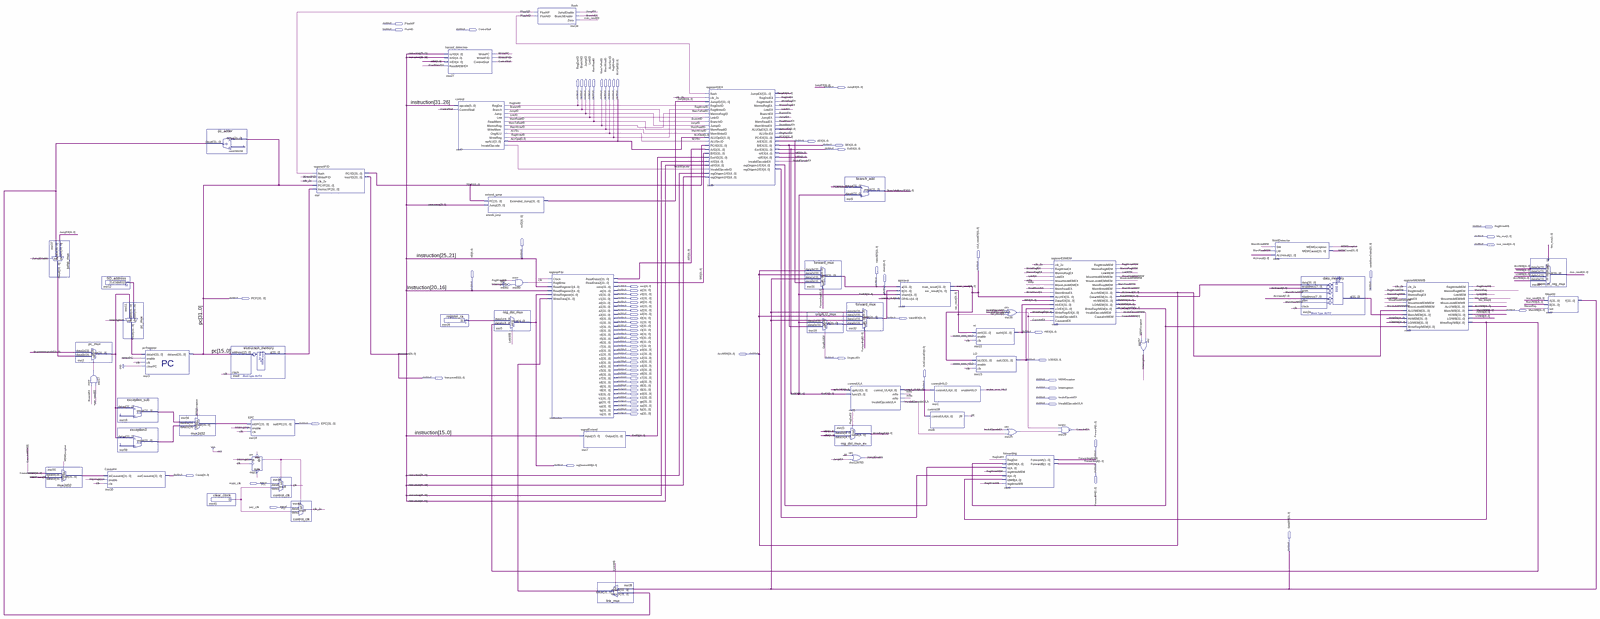
[diagram p0: schematic sheet, whole]
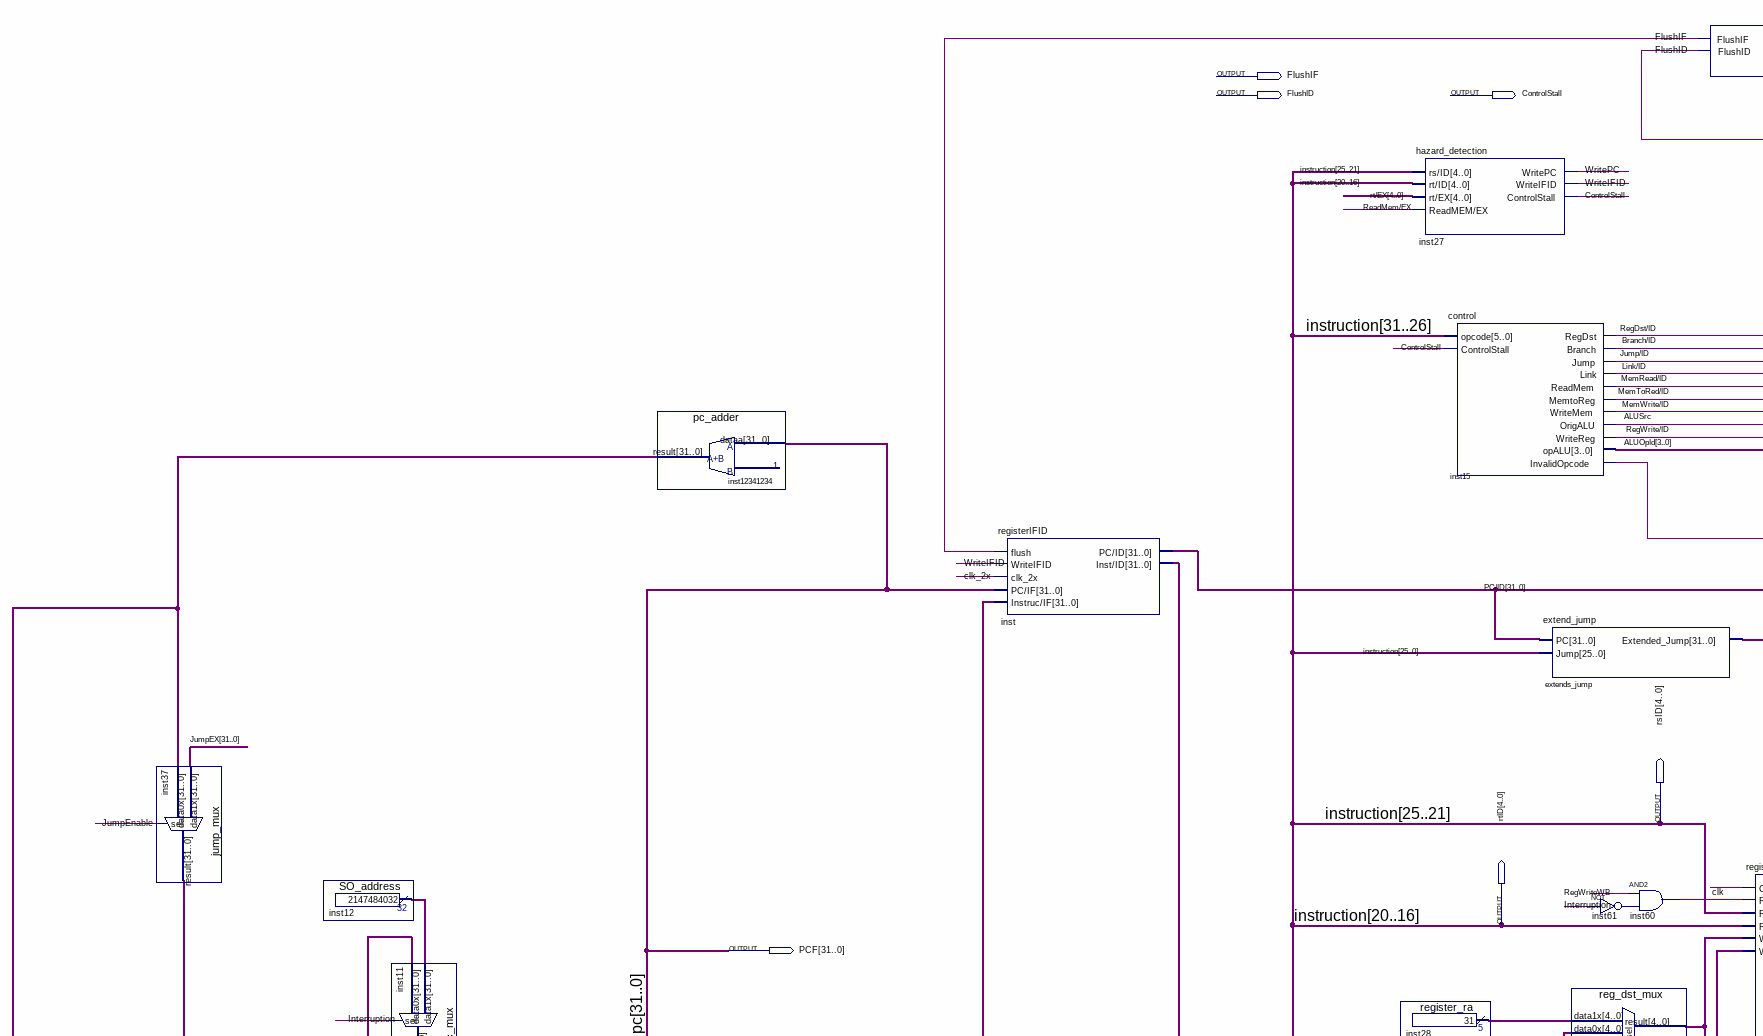
[diagram p1: schematic sheet, upper left part]
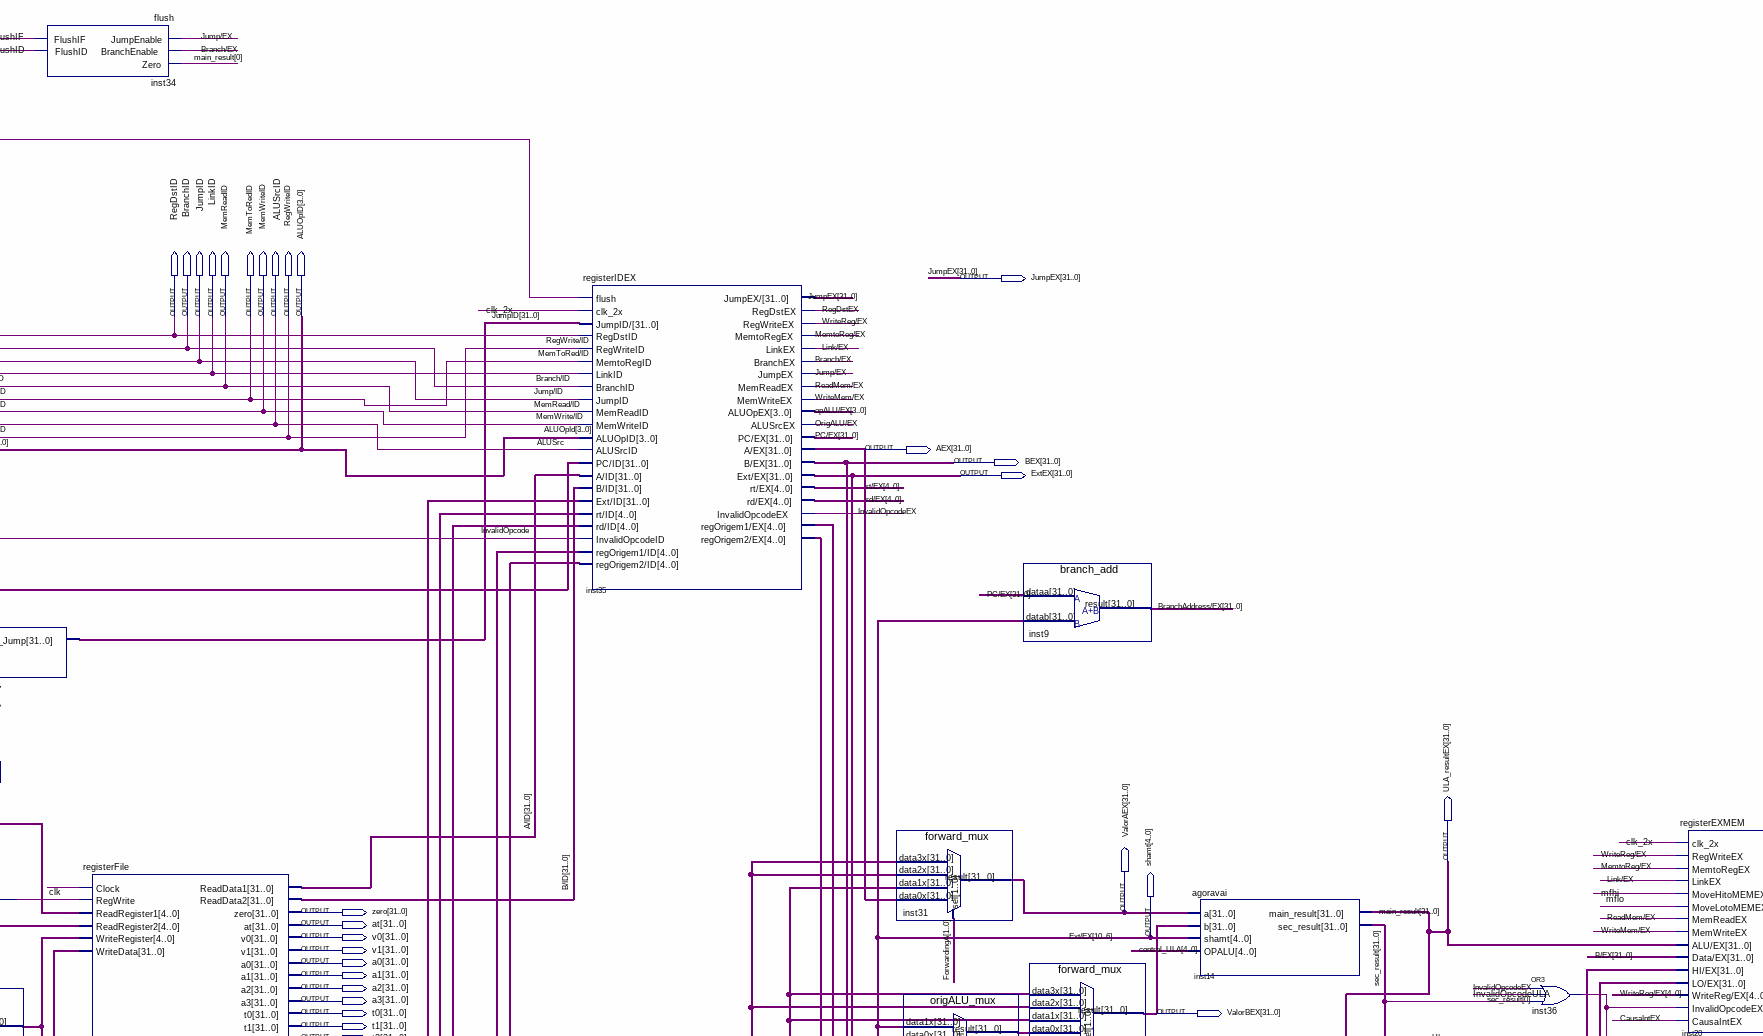
[diagram p2: schematic sheet, upper centre part]
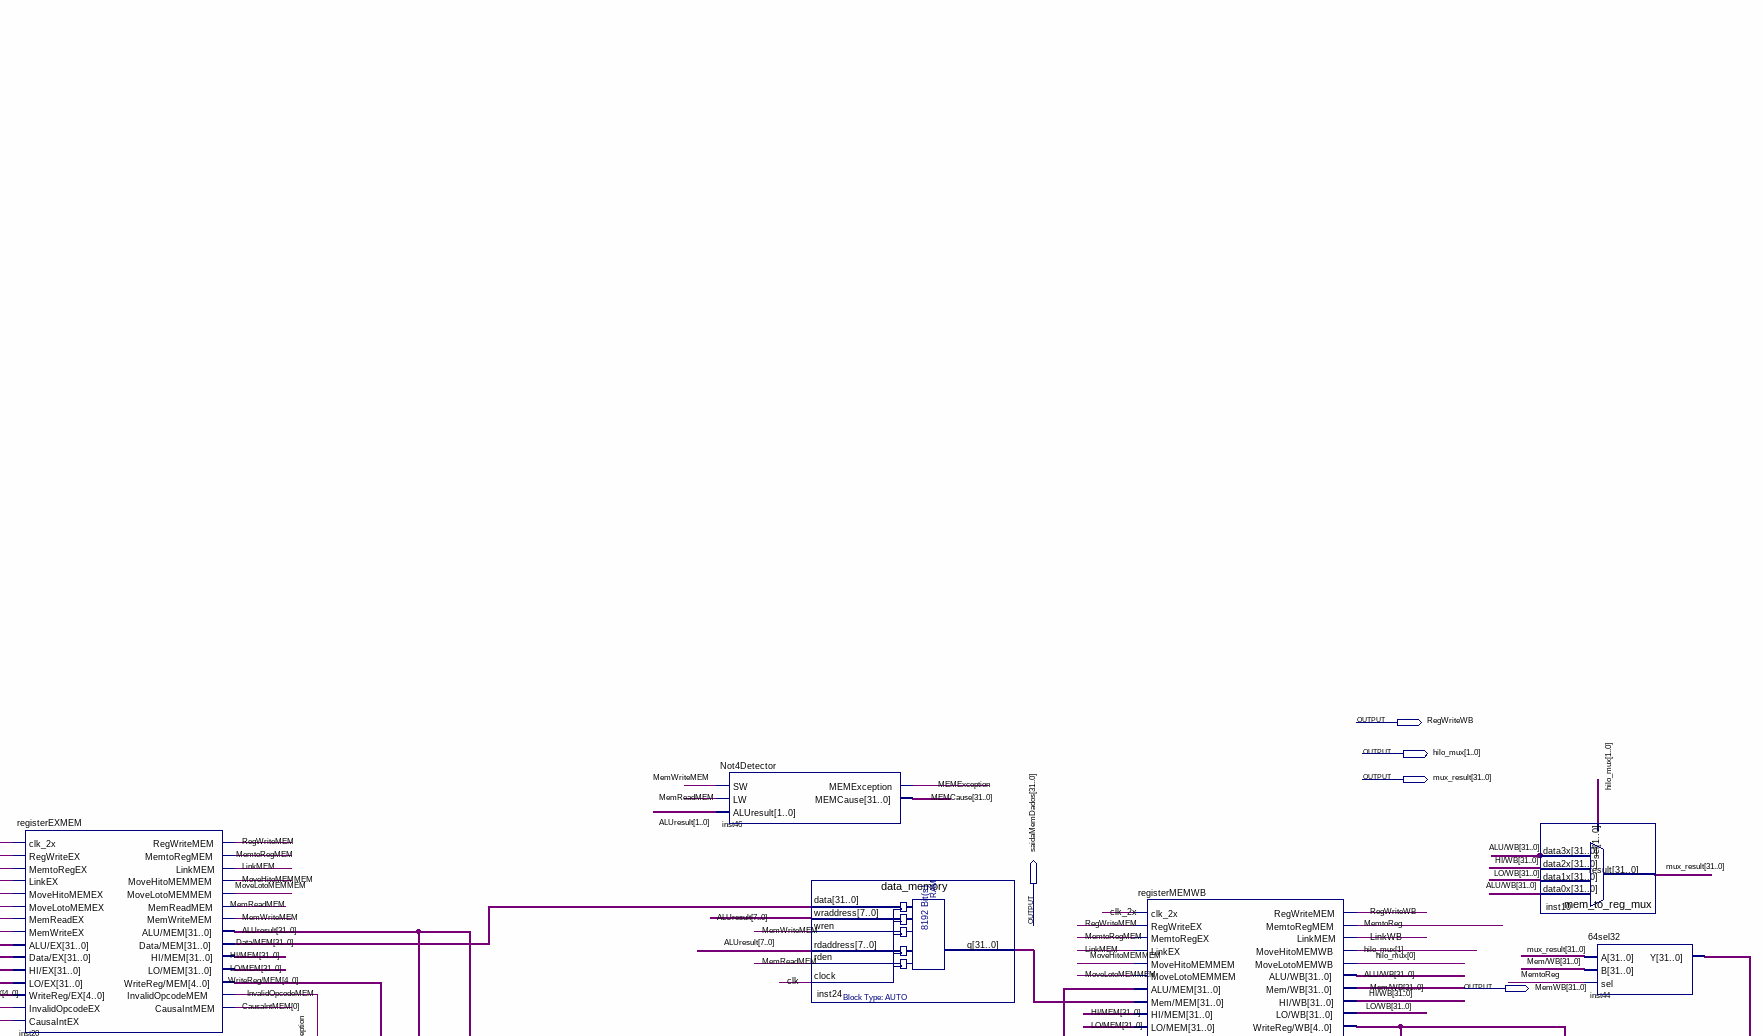
[diagram p3: schematic sheet, upper right part]
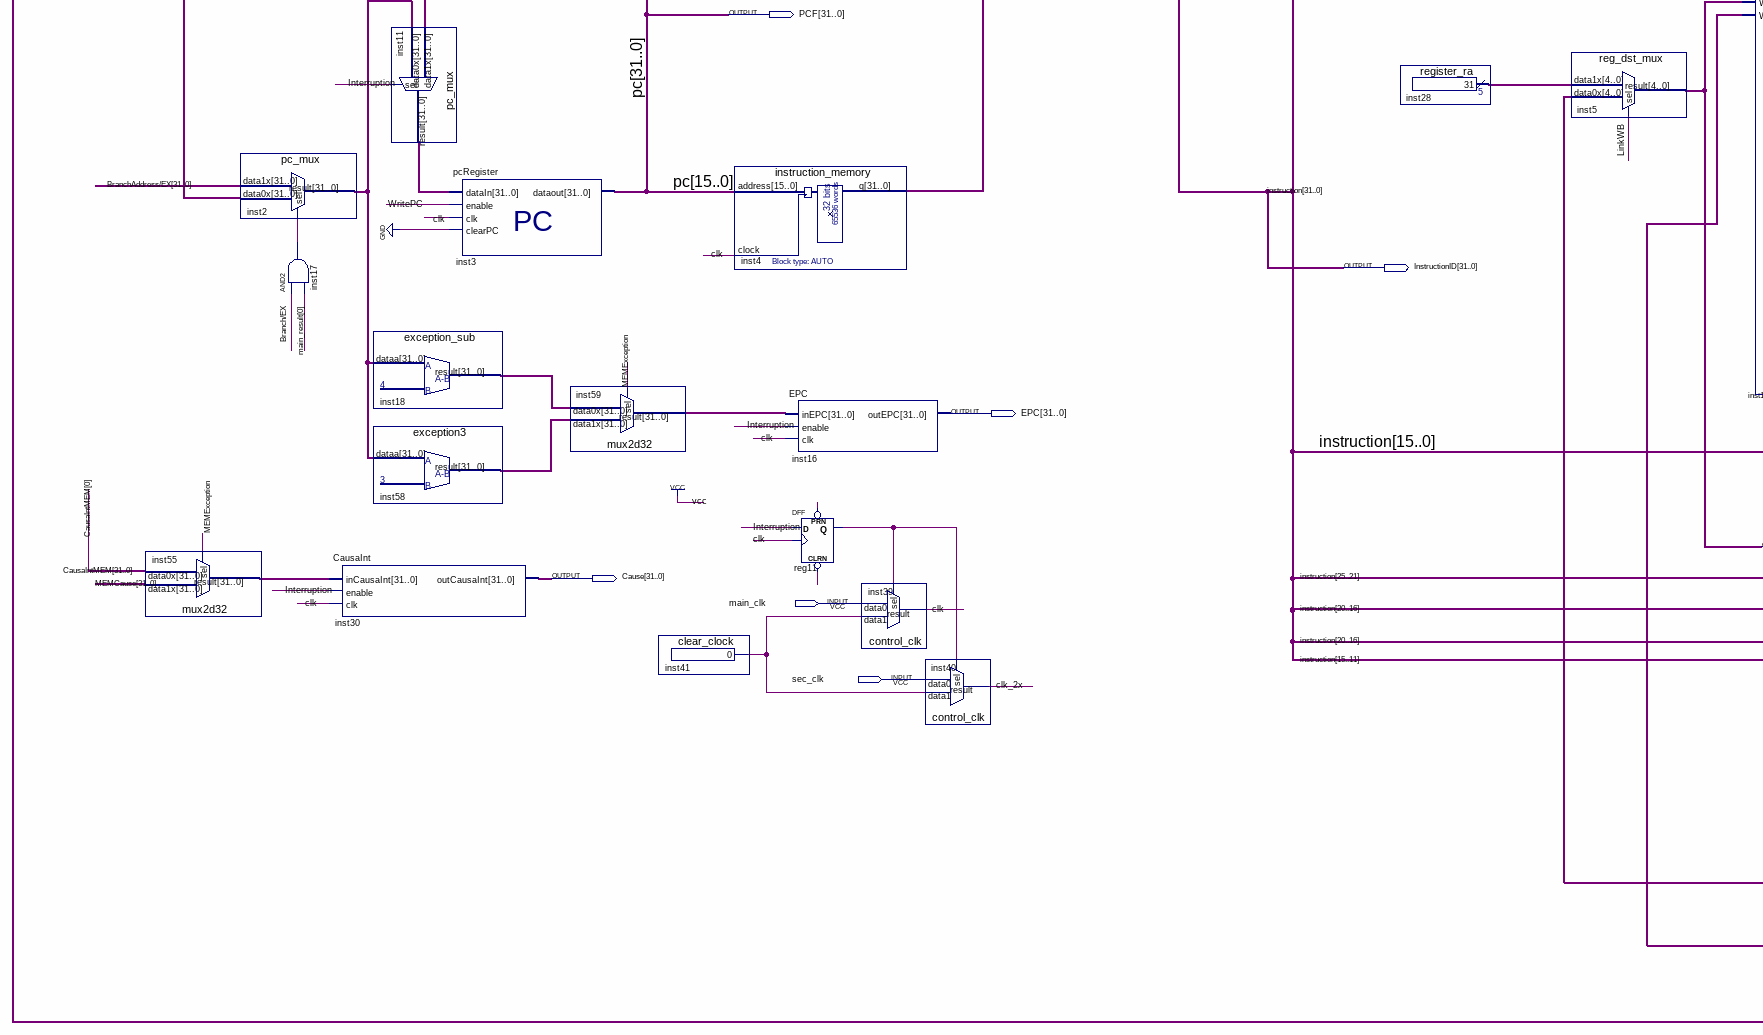
[diagram p4: schematic sheet, lower left part]
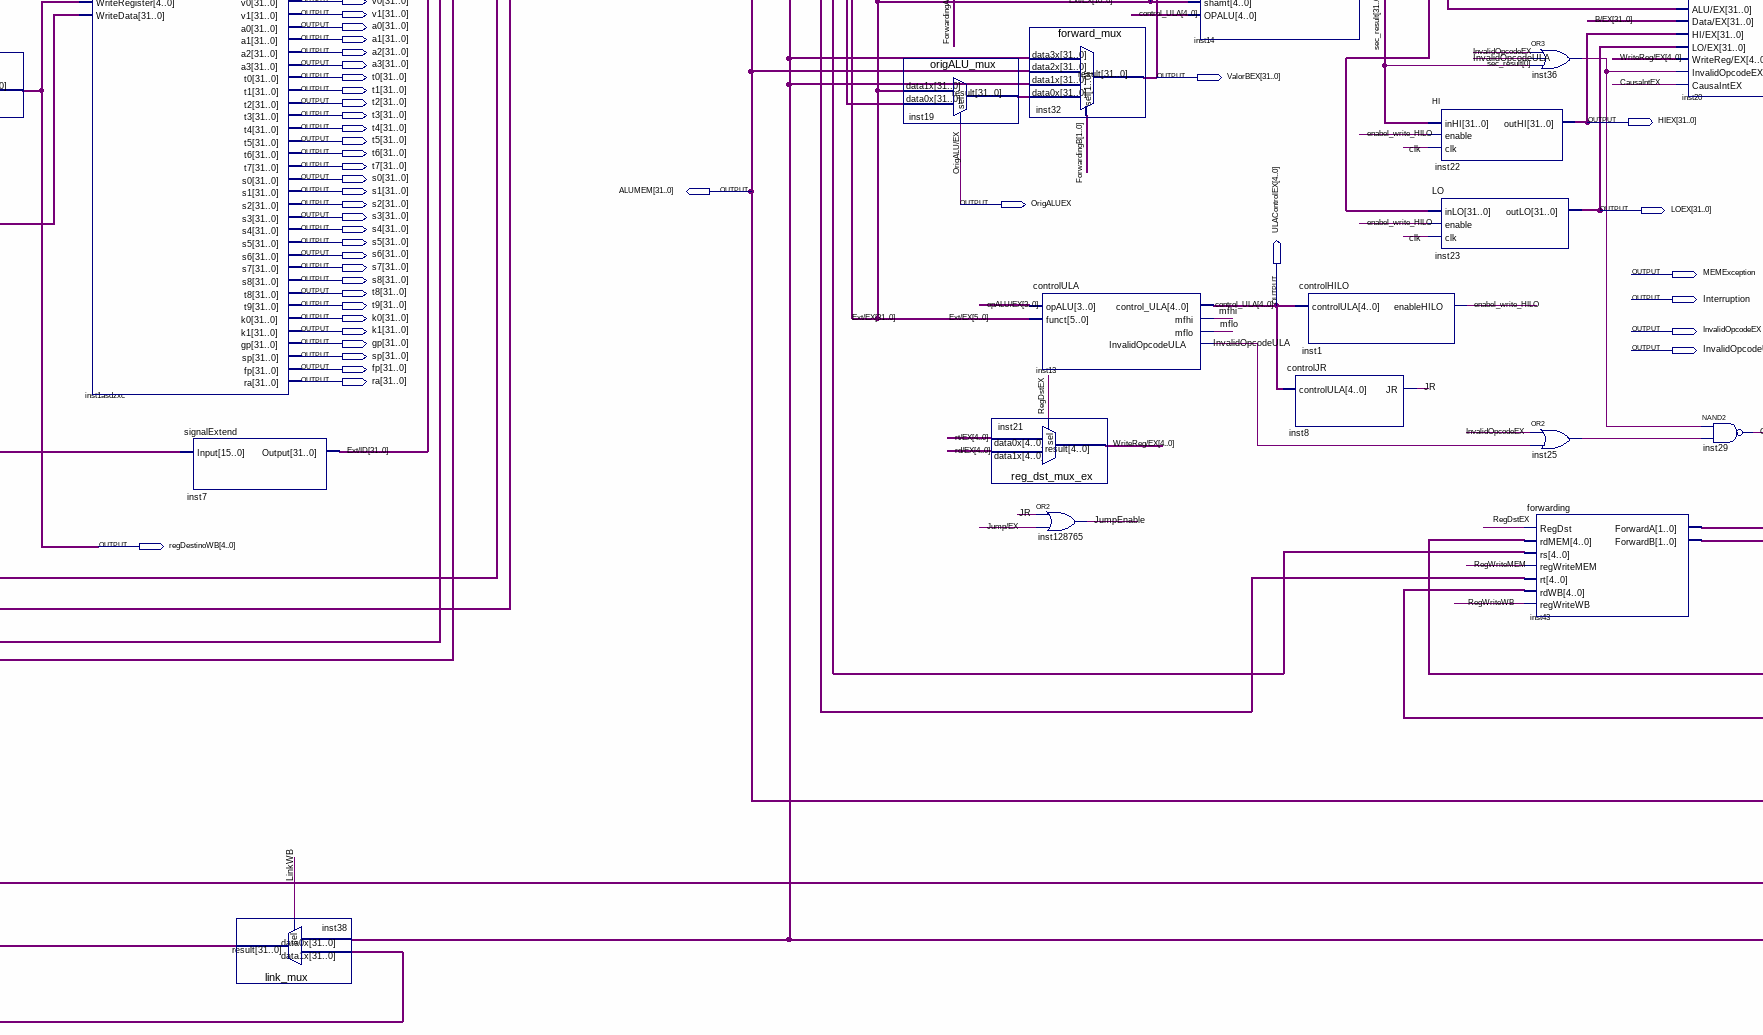
[diagram p5: schematic sheet, lower centre part]
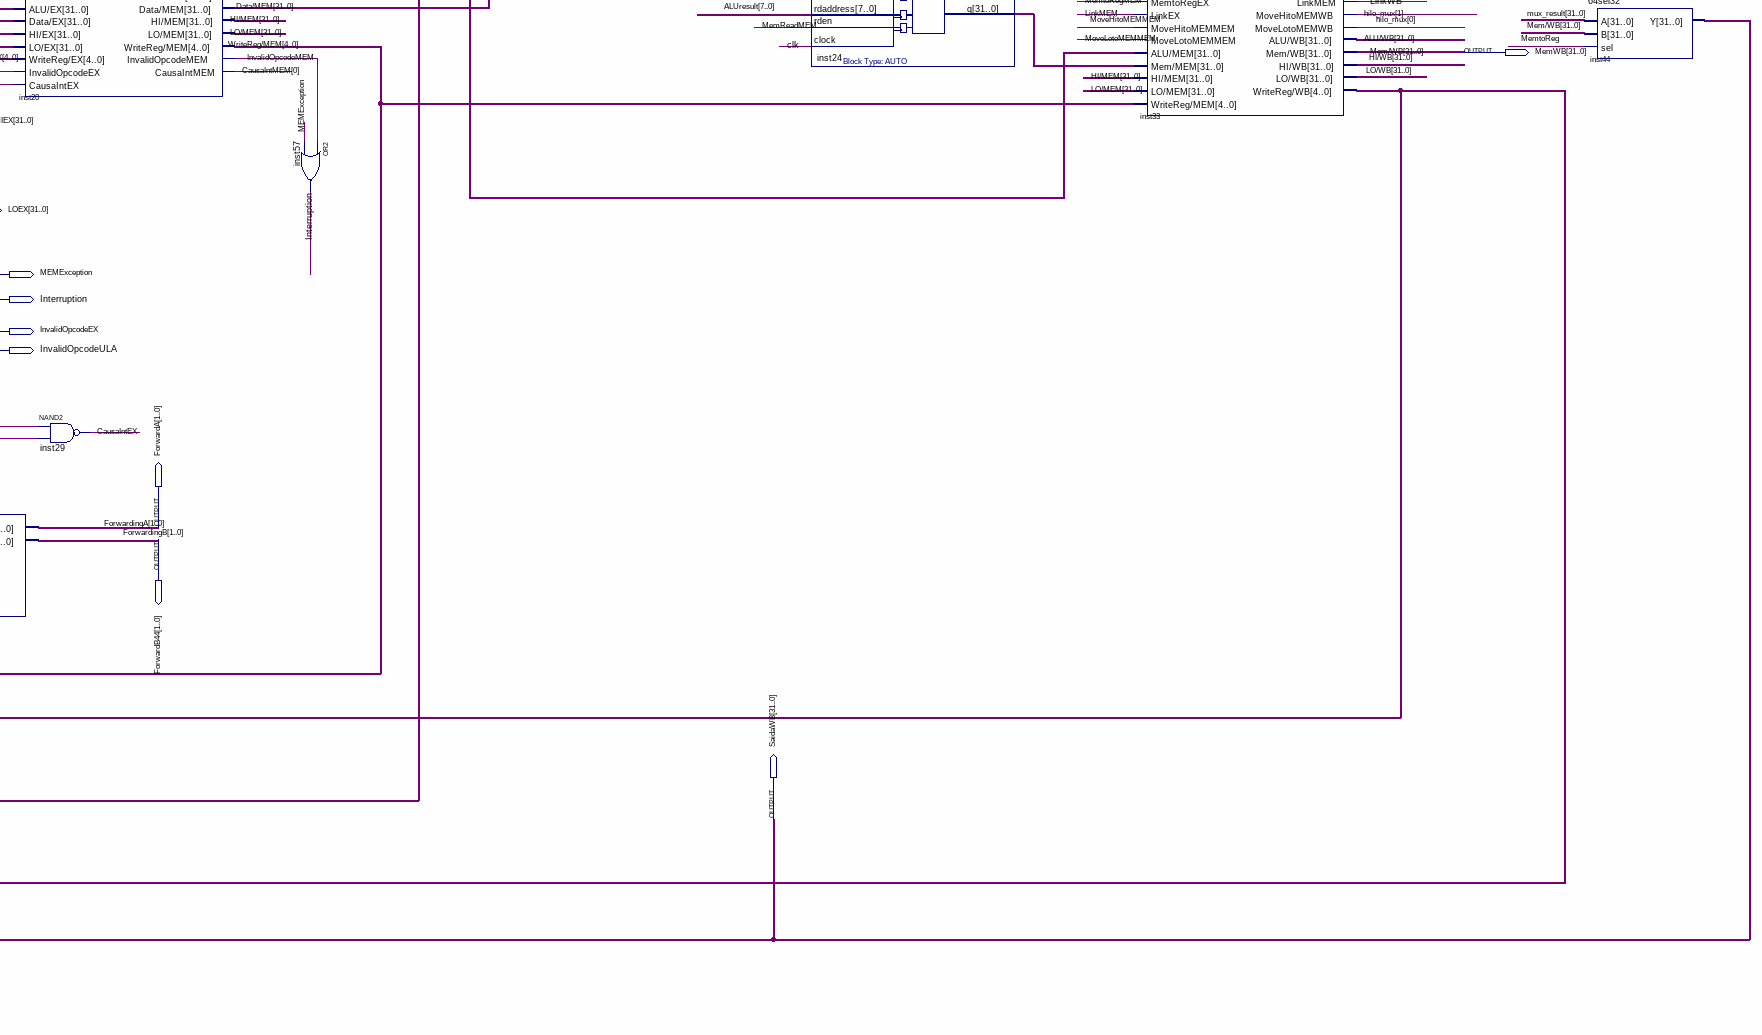
[diagram p6: schematic sheet, lower right part]
// Quartus schematic lab2.bdf as structural Verilog: 54 symbols, 80 pins
module lab2 (
  input  main_clk,
  input  sec_clk,
  output FlushIF,
  output FlushID,
  output ControlStall,
  output [31:0] JumpEX,
  output RegDstID,
  output BranchID,
  output JumpID,
  output LinkID,
  output MemReadID,
  output MemToRedID,
  output MemWriteID,
  output ALUSrcID,
  output RegWriteID,
  output [3:0] ALUOpID,
  output [31:0] AEX,
  output [31:0] BEX,
  output [31:0] ExtEX,
  output RegWriteWB,
  output [1:0] hilo_mux,
  output [31:0] mux_result,
  output [4:0] rsID,
  output [31:0] ULA_resultEX,
  output [31:0] zero,
  output [31:0] ValorAEX,
  output [4:0] rtID,
  output [31:0] at,
  output [31:0] saidaMemDados,
  output [31:0] v0,
  output [4:0] shamt,
  output [31:0] PCF,
  output [31:0] v1,
  output [31:0] a0,
  output [31:0] a1,
  output [31:0] a2,
  output [31:0] MemWB,
  output [31:0] a3,
  output [31:0] t0,
  output [31:0] ValorBEX,
  output [31:0] t1,
  output [31:0] t2,
  output [31:0] t3,
  output [31:0] HIEX,
  output [31:0] t4,
  output [31:0] t5,
  output [31:0] t6,
  output [31:0] t7,
  output [31:0] s0,
  output [31:0] s1,
  output [31:0] ALUMEM,
  output [31:0] s2,
  output OrigALUEX,
  output [31:0] LOEX,
  output [31:0] s3,
  output [31:0] s4,
  output [31:0] s5,
  output [31:0] s6,
  output [31:0] InstructionID,
  output [31:0] s7,
  output MEMException,
  output [31:0] s8,
  output [31:0] t8,
  output Interruption,
  output [31:0] t9,
  output [4:0] ULAControlEX,
  output [31:0] k0,
  output [31:0] k1,
  output InvalidOpcodeEX,
  output [31:0] gp,
  output InvalidOpcodeULA,
  output [31:0] sp,
  output [31:0] fp,
  output [31:0] ra,
  output [31:0] EPC,
  output [1:0] ForwardA,
  output [1:0] ForwardB44,
  output [4:0] regDestinoWB,
  output [31:0] Cause,
  output [31:0] SaidaWB
);

  wire \Branch/EX , CausaIntEX, clk, clk_2x, enabel_write_HILO, inst17_out, inst25_out, inst36_out,
       inst41_result, inst60_out, inst61_out, InvalidOpcode, InvalidOpcodeMEM, JR, \Jump/EX , JumpEnable,
       \Link/EX , LinkMEM, LinkWB, MemReadMEM, MemtoReg, \MemtoReg/EX , MemtoRegMEM, MemWriteMEM, mfhi, mflo,
       MoveHitoMEMMEM, MoveLotoMEMMEM, \ReadMem/EX , reg11_q, RegDstEX, RegWriteMEM, WriteIFID,
       \WriteMem/EX , WritePC, \WriteReg/EX_1bit ;
  wire [3:0] \opALU/EX ;
  wire [4:0] inst28_result, inst33_writereg_wb, inst35_regorigem1_ex, inst35_regorigem2_ex, \rd/EX , \rt/EX ,
       \WriteReg/EX , \WriteReg/MEM ;
  wire [31:0] \A/ID , \ALU/WB , \B/ID , \BranchAddress/EX , CausaIntMEM, \Data/MEM , \Ext/ID , \HI/MEM ,
       \HI/WB , inst2_result, inst4_q, inst11_result, inst12_result, inst18_result, inst19_result, inst24_q,
       inst37_result, inst38_result, inst55_result, inst58_result, inst59_result, inst12341234_result,
       JumpID_bus, \LO/MEM , \LO/WB , MEMCause, \PC/EX , \PC/ID , sec_result;

  jump_mux inst37 (.data1x(JumpEX), .data0x(inst12341234_result), .sel(JumpEnable), .result(inst37_result));
  mux2d32 inst55 (.data1x(MEMCause), .data0x(CausaIntMEM), .sel(MEMException), .result(inst55_result));
  pc_mux inst2 (.data1x(\BranchAddress/EX ), .data0x(inst37_result), .sel(inst17_out), .result(inst2_result));
  and inst17 (inst17_out, \Branch/EX , ULA_resultEX[0]);
  SO_address inst12 (.result(inst12_result));
  CausaInt inst30 (.inCausaInt(inst55_result), .enable(Interruption), .clk(clk), .outCausaInt(Cause));
  pc_mux inst11 (.data1x(inst12_result), .data0x(inst2_result), .sel(Interruption), .result(inst11_result));
  exception_sub inst18 (.dataa(inst2_result), .result(inst18_result));
  exception3 inst58 (.dataa(inst2_result), .result(inst58_result));
  pcRegister inst3 (.dataIn(inst11_result), .enable(WritePC), .clk(clk), .clearPC(1'b0), .dataout(PCF));
  mux2d32 inst59 (.data1x(inst58_result), .data0x(inst18_result), .sel(MEMException), .result(inst59_result));
  pc_adder inst12341234 (.dataa(PCF), .result(inst12341234_result));
  clear_clock inst41 (.result(inst41_result));
  instruction_memory inst4 (.address(PCF[15:0]), .clock(clk), .q(inst4_q));
  EPC inst16 (.inEPC(inst59_result), .enable(Interruption), .clk(clk), .outEPC(EPC));
  DFF reg11 (.CLRN(1'b1), .CLK(clk), .D(Interruption), .PRN(1'b1), .Q(reg11_q));
  control_clk inst39 (.data1(inst41_result), .data0(main_clk), .sel(reg11_q), .result(clk));
  control_clk inst40 (.data1(inst41_result), .data0(sec_clk), .sel(reg11_q), .result(clk_2x));
  registerIFID inst (
    .flush(FlushIF), .WriteIFID(WriteIFID), .clk_2x(clk_2x), .\PC/IF (PCF), .\Instruc/IF (inst4_q),
    .\PC/ID (\PC/ID ), .\Inst/ID (InstructionID));
  register_ra inst28 (.result(inst28_result));
  hazard_detection inst27 (
    .\rs/ID (InstructionID[25:21]), .\rt/ID (InstructionID[20:16]), .\rt/EX (\rt/EX ),
    .\ReadMEM/EX (\ReadMem/EX ), .WritePC(WritePC), .WriteIFID(WriteIFID), .ControlStall(ControlStall));
  control inst15 (
    .opcode(InstructionID[31:26]), .ControlStall(ControlStall), .RegDst(RegDstID), .Branch(BranchID),
    .Jump(JumpID), .Link(LinkID), .ReadMem(MemReadID), .MemtoReg(MemToRedID), .WriteMem(MemWriteID),
    .OrigALU(ALUSrcID), .WriteReg(RegWriteID), .opALU(ALUOpID), .InvalidOpcode(InvalidOpcode));
  extend_jump extends_jump (.PC(\PC/ID ), .Jump(InstructionID[25:0]), .Extended_Jump(JumpID_bus));
  not inst61 (inst61_out, Interruption);
  reg_dst_mux inst5 (.data1x(inst28_result), .data0x(inst33_writereg_wb), .sel(LinkWB), .result(regDestinoWB));
  and inst60 (inst60_out, RegWriteWB, inst61_out);
  flush inst34 (
    .JumpEnable(\Jump/EX ), .BranchEnable(\Branch/EX ), .Zero(ULA_resultEX[0]), .FlushIF(FlushIF),
    .FlushID(FlushID));
  registerFile inst1asdzxc (
    .Clock(clk), .RegWrite(inst60_out), .ReadRegister1(InstructionID[25:21]),
    .ReadRegister2(InstructionID[20:16]), .WriteRegister(regDestinoWB), .WriteData(inst38_result),
    .ReadData1(\A/ID ), .ReadData2(\B/ID ), .zero(zero), .at(at), .v0(v0), .v1(v1), .a0(a0), .a1(a1),
    .a2(a2), .a3(a3), .t0(t0), .t1(t1), .t2(t2), .t3(t3), .t4(t4), .t5(t5), .t6(t6), .t7(t7), .s0(s0),
    .s1(s1), .s2(s2), .s3(s3), .s4(s4), .s5(s5), .s6(s6), .s7(s7), .s8(s8), .t8(t8), .t9(t9), .k0(k0),
    .k1(k1), .gp(gp), .sp(sp), .fp(fp), .ra(ra));
  signalExtend inst7 (.Input(InstructionID[15:0]), .Output(\Ext/ID ));
  link_mux inst38 (.data1x(inst12341234_result), .data0x(SaidaWB), .sel(LinkWB), .result(inst38_result));
  registerIDEX inst35 (
    .flush(FlushID), .clk_2x(clk_2x), .\JumpID/ (JumpID_bus), .RegDstID(RegDstID), .RegWriteID(RegWriteID),
    .MemtoRegID(MemToRedID), .LinkID(LinkID), .BranchID(BranchID), .JumpID(JumpID), .MemReadID(MemReadID),
    .MemWriteID(MemWriteID), .ALUOpID(ALUOpID), .ALUSrcID(ALUSrcID), .\PC/ID (\PC/ID ), .\A/ID (\A/ID ),
    .\B/ID (\B/ID ), .\Ext/ID (\Ext/ID ), .\rt/ID (InstructionID[20:16]), .\rd/ID (InstructionID[15:11]),
    .InvalidOpcodeID(InvalidOpcode), .\regOrigem1/ID (InstructionID[25:21]),
    .\regOrigem2/ID (InstructionID[20:16]), .\JumpEX/ (JumpEX), .RegDstEX(RegDstEX),
    .RegWriteEX(\WriteReg/EX_1bit ), .MemtoRegEX(\MemtoReg/EX ), .LinkEX(\Link/EX ), .BranchEX(\Branch/EX ),
    .JumpEX(\Jump/EX ), .MemReadEX(\ReadMem/EX ), .MemWriteEX(\WriteMem/EX ), .ALUOpEX(\opALU/EX ),
    .ALUSrcEX(OrigALUEX), .\PC/EX (\PC/EX ), .\A/EX (AEX), .\B/EX (BEX), .\Ext/EX (ExtEX), .\rt/EX (\rt/EX ),
    .\rd/EX (\rd/EX ), .InvalidOpcodeEX(InvalidOpcodeEX), .\regOrigem1/EX (inst35_regorigem1_ex),
    .\regOrigem2/EX (inst35_regorigem2_ex));
  forward_mux inst31 (
    .data3x(ALUMEM), .data2x(ALUMEM), .data1x(SaidaWB), .data0x(AEX), .sel(ForwardA), .result(ValorAEX));
  origALU_mux inst19 (.data1x(ExtEX), .data0x(BEX), .sel(OrigALUEX), .result(inst19_result));
  reg_dst_mux_ex inst21 (.data1x(\rd/EX ), .data0x(\rt/EX ), .sel(RegDstEX), .result(\WriteReg/EX ));
  branch_add inst9 (.dataa(\PC/EX ), .datab(ExtEX), .result(\BranchAddress/EX ));
  forward_mux inst32 (
    .data3x(SaidaWB), .data2x(ALUMEM), .data1x(SaidaWB), .data0x(inst19_result), .sel(ForwardB44),
    .result(ValorBEX));
  controlULA inst13 (
    .opALU(\opALU/EX ), .funct(ExtEX[5:0]), .control_ULA(ULAControlEX), .mfhi(mfhi), .mflo(mflo),
    .InvalidOpcodeULA(InvalidOpcodeULA));
  or inst128765 (JumpEnable, JR, \Jump/EX );
  agoravai inst14 (
    .a(ValorAEX), .b(ValorBEX), .shamt(ExtEX[10:6]), .OPALU(ULAControlEX), .main_result(ULA_resultEX),
    .sec_result(sec_result));
  controlHILO inst1 (.controlULA(ULAControlEX), .enableHILO(enabel_write_HILO));
  controlJR inst8 (.controlULA(ULAControlEX), .JR(JR));
  HI inst22 (.inHI(sec_result), .enable(enabel_write_HILO), .clk(clk), .outHI(HIEX));
  LO inst23 (.inLO(ULA_resultEX), .enable(enabel_write_HILO), .clk(clk), .outLO(LOEX));
  or inst36 (inst36_out, InvalidOpcodeEX, InvalidOpcodeULA, sec_result[0]);
  or inst25 (inst25_out, InvalidOpcodeEX, InvalidOpcodeULA);
  forwarding inst43 (
    .RegDst(RegDstEX), .rdMEM(\WriteReg/MEM ), .rs(inst35_regorigem1_ex), .regWriteMEM(RegWriteMEM),
    .rt(inst35_regorigem2_ex), .rdWB(inst33_writereg_wb), .regWriteWB(RegWriteWB), .ForwardA(ForwardA),
    .ForwardB(ForwardB44));
  registerEXMEM inst20 (
    .clk_2x(clk_2x), .RegWriteEX(\WriteReg/EX_1bit ), .MemtoRegEX(\MemtoReg/EX ), .LinkEX(\Link/EX ),
    .MoveHitoMEMEX(mfhi), .MoveLotoMEMEX(mflo), .MemReadEX(\ReadMem/EX ), .MemWriteEX(\WriteMem/EX ),
    .\ALU/EX (ULA_resultEX), .\Data/EX (BEX), .\HI/EX (HIEX), .\LO/EX (LOEX), .\WriteReg/EX (\WriteReg/EX ),
    .InvalidOpcodeEX(inst36_out), .CausaIntEX(CausaIntEX), .RegWriteMEM(RegWriteMEM),
    .MemtoRegMEM(MemtoRegMEM), .LinkMEM(LinkMEM), .MoveHitoMEMMEM(MoveHitoMEMMEM),
    .MoveLotoMEMMEM(MoveLotoMEMMEM), .MemReadMEM(MemReadMEM), .MemWriteMEM(MemWriteMEM), .\ALU/MEM (ALUMEM),
    .\Data/MEM (\Data/MEM ), .\HI/MEM (\HI/MEM ), .\LO/MEM (\LO/MEM ), .\WriteReg/MEM (\WriteReg/MEM ),
    .InvalidOpcodeMEM(InvalidOpcodeMEM), .CausaIntMEM(CausaIntMEM[0]));
  nand inst29 (CausaIntEX, inst36_out, inst25_out);
  or inst57 (Interruption, InvalidOpcodeMEM, MEMException);
  Not4Detector inst46 (
    .SW(MemWriteMEM), .LW(MemReadMEM), .ALUresult(ALUMEM[1:0]), .MEMException(MEMException),
    .MEMCause(MEMCause));
  data_memory inst24 (
    .data(\Data/MEM ), .wraddress(ALUMEM[7:0]), .wren(MemWriteMEM), .rdaddress(ALUMEM[7:0]),
    .rden(MemReadMEM), .clock(clk), .q(inst24_q));
  registerMEMWB inst33 (
    .clk_2x(clk_2x), .RegWriteEX(RegWriteMEM), .MemtoRegEX(MemtoRegMEM), .LinkEX(LinkMEM),
    .MoveHitoMEMMEM(MoveHitoMEMMEM), .MoveLotoMEMMEM(MoveLotoMEMMEM), .\ALU/MEM (ALUMEM),
    .\Mem/MEM (inst24_q), .\HI/MEM (\HI/MEM ), .\LO/MEM (\LO/MEM ), .\WriteReg/MEM (\WriteReg/MEM ),
    .RegWriteMEM(RegWriteWB), .MemtoRegMEM(MemtoReg), .LinkMEM(LinkWB), .MoveHitoMEMWB(hilo_mux[1]),
    .MoveLotoMEMWB(hilo_mux[0]), .\ALU/WB (\ALU/WB ), .\Mem/WB (MemWB), .\HI/WB (\HI/WB ), .\LO/WB (\LO/WB ),
    .\WriteReg/WB (inst33_writereg_wb));
  mem_to_reg_mux inst10 (
    .data3x(\ALU/WB ), .data2x(\HI/WB ), .data1x(\LO/WB ), .data0x(\ALU/WB ), .sel(hilo_mux),
    .result(mux_result));
  \64sel32  inst44 (.A(mux_result), .B(MemWB), .sel(MemtoReg), .Y(SaidaWB));

  assign rsID = InstructionID[25:21];
  assign rtID = InstructionID[20:16];
  assign shamt = ExtEX[10:6];

  // Other names for the same wires on the sheet: ALUresult[31:0] = ALUMEM; ALUSrc = ALUSrcID; B/EX[31:0] = BEX;
  //   Branch/ID = BranchID; control_ULA[4:0] = ULAControlEX; Ext/EX[31:0] = ExtEX; ForwardingA[1:0] = ForwardA;
  //   ForwardingB[1:0] = ForwardB44; instruction[31:0] = InstructionID; Jump/ID = JumpID; Link/ID = LinkID;
  //   main_result[31:0] = ULA_resultEX; Mem/WB[31:0] = MemWB; MemRead/ID = MemReadID; MemToRed/ID = MemToRedID;
  //   MemWrite/ID = MemWriteID; OrigALU/EX = OrigALUEX; pc[31:0] = PCF; RegDst/ID = RegDstID;
  //   RegWrite/ID = RegWriteID
endmodule
